# Altium project MCUBreakoutBoard.PrjPcb
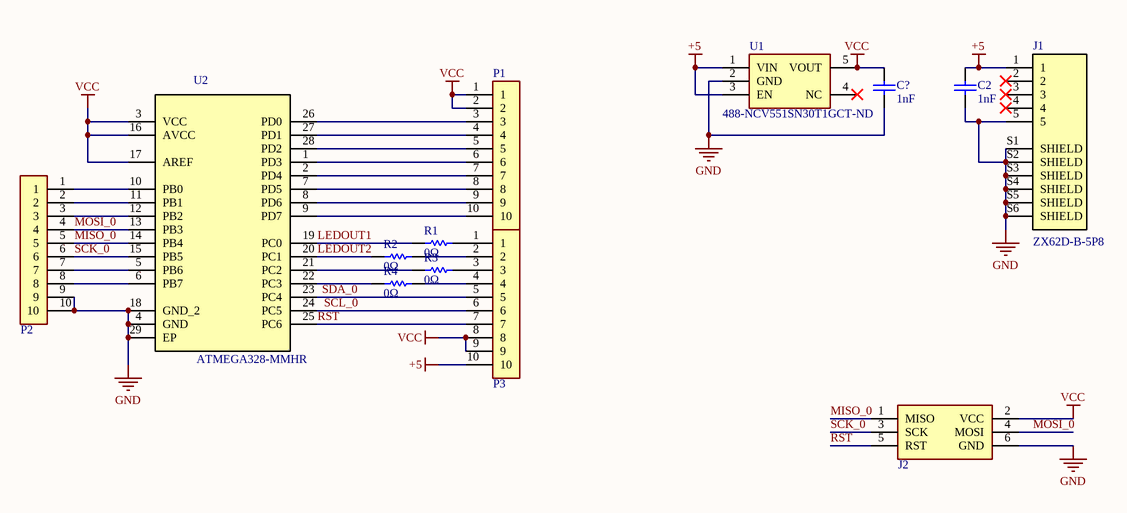
[diagram p0: Breakout.SchDoc]
1 sheet, 13 parts. Net scope: global (net labels, ports and power ports of the same name join across sheets).
Board file: MCUBreakout.PcbDoc

## Sheet Breakout.SchDoc
size A

### Parts
C2  1nF  [0603_CAP]
C?  1nF  [0603_CAP]
J1  ZX62D-B-5P8  [Micro_USB]
J2  6 Pin ISP Header  [CONN_ISP_M]  (value not drawn)
P1  HEADER_1x10  [PIN10]  (value not drawn)
P2  HEADER_1x10  [PIN10]  (value not drawn)
P3  HEADER_1x10  [PIN10]  (value not drawn)
R1  0Ω  [0603_RES]
R2  0Ω  [0603_RES]
R3  0Ω  [0603_RES]
R4  0Ω  [0603_RES]
U1  Supplier Part Number 1: 488-NCV551SN30T1GCT-ND  [TSOP-5-N]  (hidden comment: NCV551SN30T1G)
U2  ATMEGA328-MMHR  [QFN-28_4x4]

### Nets
+5: C2.2 J1.1 P3.10 U1.1(VIN) U1.3(EN)
GND: C2.1 C?.1 J1.5 J1.S1(SHIELD) J1.S2(SHIELD) J1.S3(SHIELD) J1.S4(SHIELD) J1.S5(SHIELD) J1.S6(SHIELD) J2.6(GND) P2.9 P2.10 U1.2(GND) U2.4(GND) U2.18(GND_2) U2.29(EP)
VCC: C?.2 J2.2(VCC) P1.1 P1.2 P3.8 P3.9 U1.5(VOUT) U2.3(VCC) U2.16(AVCC) U2.17(AREF)
LEDOUT1: R1.1 U2.19(PC0)
LEDOUT2: R2.1 U2.20(PC1)
MISO_0: J2.1(MISO) P2.5 U2.14(PB4)
MOSI_0: J2.4(MOSI) P2.4 U2.13(PB3)
RST: J2.5(RST) P3.7 U2.25(PC6)
SCK_0: J2.3(SCK) P2.6 U2.15(PB5)
SCL_0: P3.6 U2.24(PC5)
SDA_0: P3.5 U2.23(PC4)
NetP1_3: P1.3 U2.26(PD0)
NetP1_4: P1.4 U2.27(PD1)
NetP1_5: P1.5 U2.28(PD2)
NetP1_6: P1.6 U2.1(PD3)
NetP1_7: P1.7 U2.2(PD4)
NetP1_8: P1.8 U2.7(PD5)
NetP1_9: P1.9 U2.8(PD6)
NetP1_10: P1.10 U2.9(PD7)
NetP2_1: P2.1 U2.10(PB0)
NetP2_2: P2.2 U2.11(PB1)
NetP2_3: P2.3 U2.12(PB2)
NetP2_7: P2.7 U2.5(PB6)
NetP2_8: P2.8 U2.6(PB7)
NetP3_1: P3.1 R1.2
NetP3_2: P3.2 R2.2
NetP3_3: P3.3 R3.2
NetP3_4: P3.4 R4.2
NetR3_1: R3.1 U2.21(PC2)
NetR4_1: R4.1 U2.22(PC3)

Not connected (* = marked no-connect by the designer): J1 2* 3* 4*; U1 4(NC)*

### Library data of the parts
C2 C? = CAP_1N_0603: CAP CER 1000PF 200V X7R 0603; Published: 8-Jun-2000; LatestRevisionDate: 17-Jul-2002; LatestRevisionNote: Re-released for DXP Platform.; PackageReference: RAD-0.3; Publisher: Altium Limited; PackageDescription: Radial Cap, Thru-Hole; 2 Leads; 0.3 in Pin Spacing; Supplier 1: Digi-Key; Supplier Part Number 1: 399-11556-1-ND
J1 = MicroUSB: SMD+DIP Micro USB; MICRO-B-SMD; MF: Hirose; SnapEDA_Link: https://www.snapeda.com/parts/ZX62D-B-5P8/Hirose%20Electric%20Co%20Ltd/view-part/?ref=snap; Package: None; Price: None; MP: ZX62D-B-5P8; Availability: Unavailable; Value: *; Supplier 1: Digi-Key; Supplier Part Number 1: H125272CT-ND
J2 = ISP
R1-R4 = RES_0R_0603: RES SMD 0 OHM JUMPER 1/10W 0603; Published: 8-Jun-2000; LatestRevisionDate: 17-Jul-2002; LatestRevisionNote: Re-released for DXP Platform.; PackageReference: AXIAL-0.3; Publisher: Altium Limited; PackageDescription: Axial Device, Thru-Hole; 2 Leads; 0.3 in Pin Spacing; Supplier 1: Digi-Key; Supplier Part Number 1: 311-0.0GRDKR-ND
U1 = NCV551SN30T1G: IC REG LINEAR 3V 150MA 5TSOP; Supplier 1: Digi-Key
U2 = ATMEGA328-MMHR: IC MCU 8BIT 32KB FLASH 28VQFN; MF: Microchip; MP: ATMEGA328P-PU; SnapEDA_Link: https://www.snapeda.com/parts/ATMEGA328P-PU/Microchip/view-part/?ref=snap; Package: PDIP-28 Microchip; Price: None; Availability: Unavailable; Value: *; Supplier 1: Digi-Key; Supplier Part Number 1: ATMEGA328-MMHRCT-ND